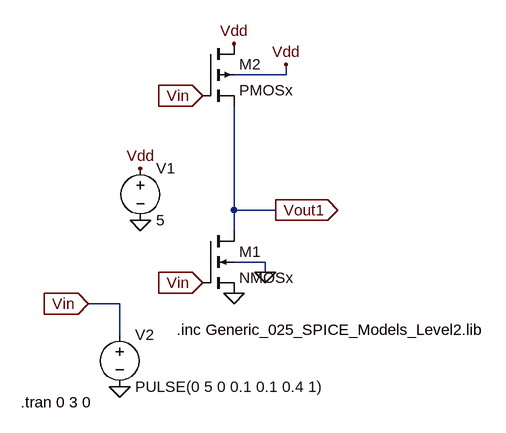
[diagram p0: schematic Setup.asc]
Setup.asc, the LTspice schematic file:
Version 4
SHEET 1 2972 680
WIRE 112 -144 112 -160
WIRE 112 -144 32 -144
WIRE 32 64 32 -96
WIRE 96 64 32 64
WIRE 32 96 32 64
WIRE 80 144 32 144
WIRE 80 160 80 144
WIRE -144 208 -192 208
WIRE -144 256 -144 208
FLAG 32 192 0
FLAG 80 160 0
FLAG -112 80 0
FLAG -112 0 Vdd
FLAG -144 336 0
FLAG -192 208 Vin
IOPIN -192 208 In
FLAG 96 64 Vout1
IOPIN 96 64 Out
FLAG -16 176 Vin
IOPIN -16 176 In
FLAG 32 -192 Vdd
FLAG 112 -160 Vdd
FLAG -16 -112 Vin
IOPIN -16 -112 In
SYMBOL nmos4 -16 96 R0
SYMATTR InstName M1
SYMATTR Value NMOSx
SYMATTR Value2 l=0.25u w=4u
SYMBOL voltage -112 -16 R0
WINDOW 123 0 0 Left 2
WINDOW 39 0 0 Left 2
SYMATTR InstName V1
SYMATTR Value 5
SYMBOL voltage -144 240 R0
WINDOW 123 0 0 Left 2
WINDOW 39 0 0 Left 2
SYMATTR InstName V2
SYMATTR Value PULSE(0 5 0 0.1 0.1 0.4 1)
SYMBOL pmos4 -16 -192 R0
SYMATTR InstName M2
SYMATTR Value PMOSx
SYMATTR Value2 l=0.25u w=12u
TEXT -56 248 Left 2 !.inc Generic_025_SPICE_Models_Level2.lib
TEXT -296 360 Left 2 !.tran 0 3 0

The netlist it stands for:
* Setup.asc
M1 Vout1 Vin 0 0 NMOSx l=0.25u w=4u
V1 Vdd 0 5
V2 Vin 0 PULSE(0 5 0 0.1 0.1 0.4 1)
M2 Vdd Vin Vout1 Vdd PMOSx l=0.25u w=12u
.model NMOS NMOS
.model PMOS PMOS
.lib standard.mos
.inc Generic_025_SPICE_Models_Level2.lib
.tran 0 3 0
.backanno
.end